# Altium project Mynd_USB_JACK.PrjPcb
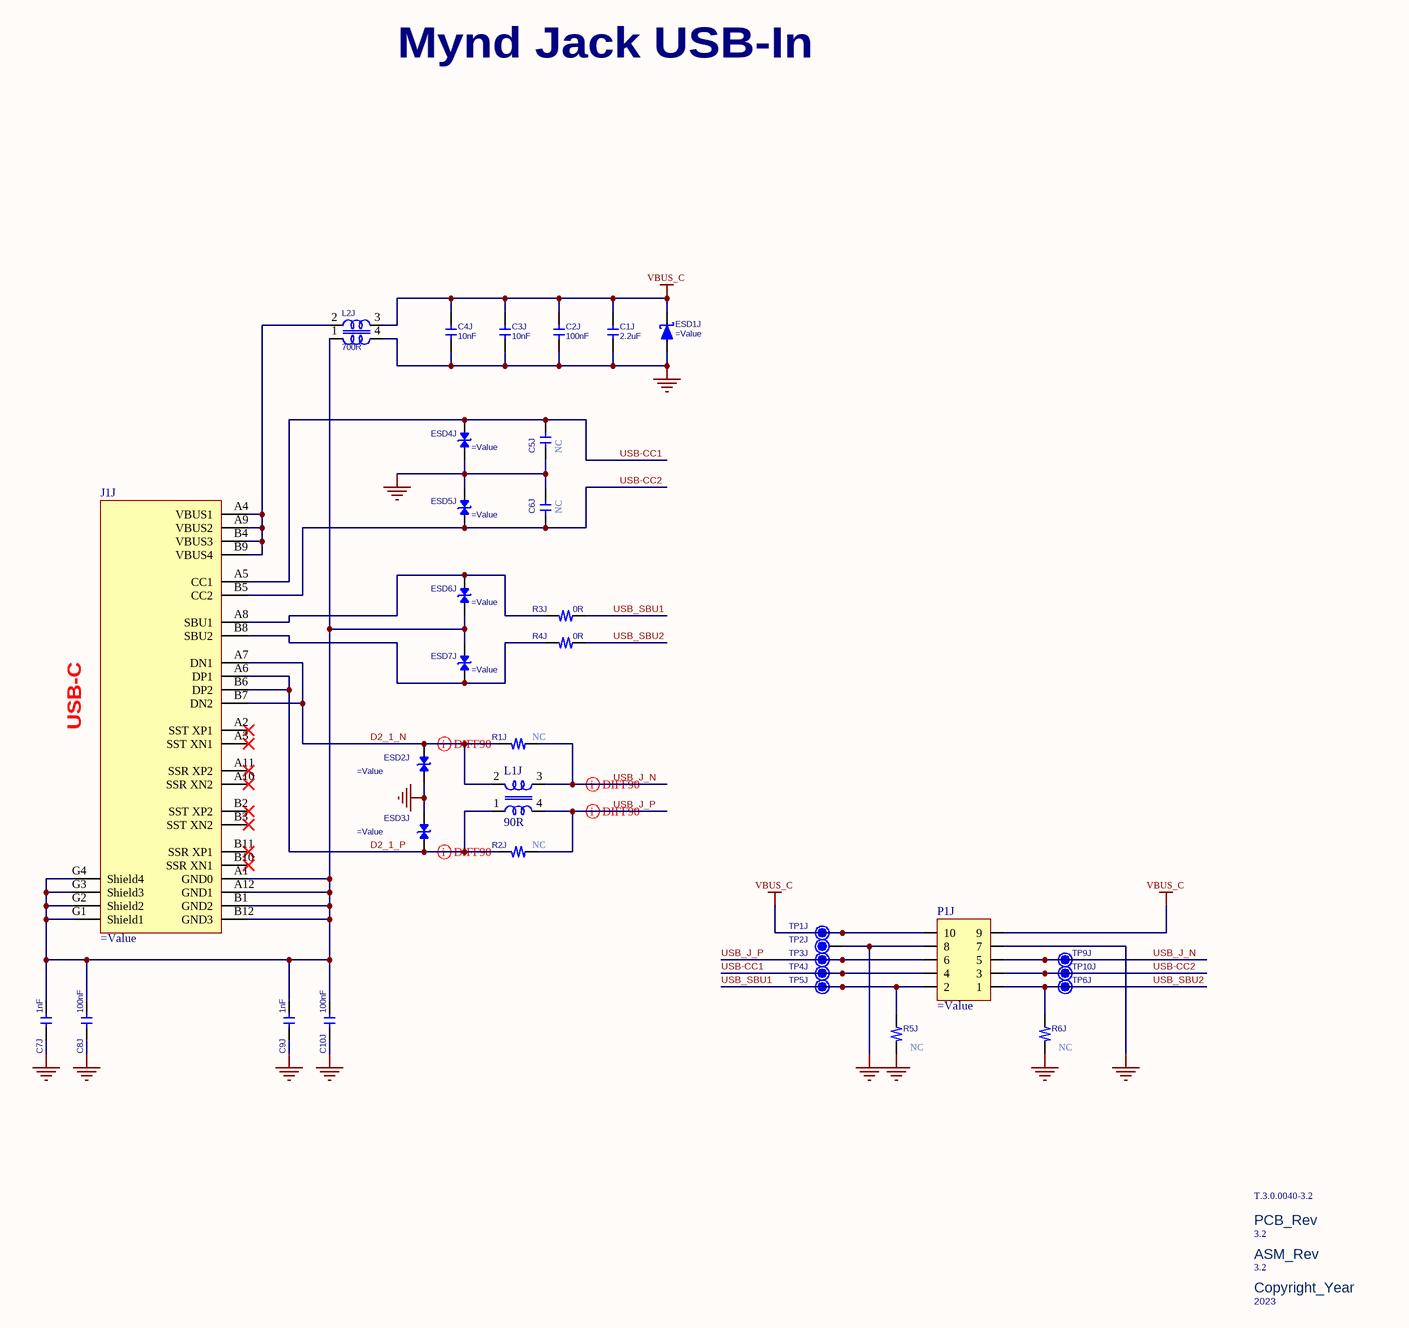
[diagram p0: Mynd_USB_JACK.SchDoc]
Revision: 3.2; Version: T.3.0.0040; SCH_REV: 3.2; SCH_Designer: GuoHui.Lin; SCH_Checker: Aileen.Zheng; SCH_Approver: JianHua.Zhong; REV_DATE: 20231025; Projects.TemplateItemRevisionGuid: B682C188-0E56-4AC2-9775-457A46DFECEF; PCB_REV: 3.2; Model_NO: PS2307; ISSUE_DATE: 20240117; Engineer: JMB, TB, JM; DOC_NO_SCH_DWG: Mynd_USB_Jack; Copyright_Year: 2023; CompanyName: Lautsprecher Teufel GmbH; ASM_Rev: 3.2; Address3: Germany; Address2: 10787 Berlin; Address1: Budapester Straße 44
1 sheet, 39 parts. Net scope: global (net labels, ports and power ports of the same name join across sheets).
Board file: Mynd_USB_JACK.PcbDoc

## Sheet Mynd_USB_JACK.SchDoc: Mynd-USB-Jack
size A3; ApprovedBy: JianHua.Zhong; CheckedBy: Aileen.Zheng; DrawnBy: GuoHui.Lin; DocumentNumber: 1; Revision: 3.2; SheetNumber: 1; SheetTotal: 1; Model NO.: PS2307; ISSUE DATE: 20240117; REV DATE: 20231025

### Parts
C1J  2.2uF  [C0805_145]
C2J  100nF  [C0603X100]
C3J  10nF  [C0603X100]
C4J  10nF  [C0603X100]
C5J  470pF  [C0603X80]  (value not drawn)
C6J  470pF  [C0603X80]  (value not drawn)
C7J  1nF  [C0603X100]
C8J  100nF  [C0603X100]
C9J  1nF  [C0603X100]
C10J  100nF  [C0603X100]
ESD1J  (no value)  [SOD-123FL]
ESD2J  (no value)  [DFN2_100X60X50_65]
ESD3J  (no value)  [DFN2_100X60X50_65]
ESD4J  (no value)  [DFN2_100X60X50_65]
ESD5J  (no value)  [DFN2_100X60X50_65]
ESD6J  (no value)  [DFN2_100X60X50_65]
ESD7J  (no value)  [DFN2_100X60X50_65]
J1J  (no value)  [USB_TYPE_C_HC_0768]
L1J  90R  [CET2012D]
L2J  700R  [DU_IND_SMD_SCM7060]
P1J  (no value)  [WB200AW_2x5P]
R1J  0R  [R0402]  (value not drawn)
R2J  0R  [R0402]  (value not drawn)
R3J  0R  [R0402]
R4J  0R  [R0402]
R5J  NC  [R0402]  (value not drawn)
R6J  NC  [R0402]  (value not drawn)
Teufel_ASM_Label1J  3.2  [Teufel_ASM_Rev]  (no BOM)
Teufel_Copyright1K  2023  [TEUFEL_COPYRIGHT]  (no BOM)
Teufel_PCB_Label1J  3.2  [Teufel_PCB_Rev]  (no BOM)
Teufel_PCB_Logo1k  T.3.0.0040-3.2  [Teufel_NoLogo]  (no BOM)
TP1J  TP12  [TP120]  (value not drawn)  (no BOM)
TP2J  TP12  [TP120]  (value not drawn)  (no BOM)
TP3J  TP12  [TP120]  (value not drawn)  (no BOM)
TP4J  TP12  [TP120]  (value not drawn)  (no BOM)
TP5J  TP12  [TP120]  (value not drawn)  (no BOM)
TP6J  TP12  [TP120]  (value not drawn)  (no BOM)
TP9J  TP12  [TP120]  (value not drawn)  (no BOM)
TP10J  TP12  [TP120]  (value not drawn)  (no BOM)

### Nets
GND: C1J.2 C2J.2 C3J.2 C4J.2 C5J.2 C6J.2 C7J.2 C8J.2 C9J.2 C10J.2 ESD1J.A ESD2J.1 ESD3J.1 ESD4J.2 ESD5J.2 L2J.4 P1J.7 P1J.8 R5J.1 R6J.1 TP2J.1
VBUS_C: C1J.1 C2J.1 C3J.1 C4J.1 ESD1J.K L2J.3 P1J.9 P1J.10 TP1J.1
D2_1_N: ESD2J.2 J1J.A7(DN1) J1J.B7(DN2) L1J.2 R1J.1
D2_1_P: ESD3J.2 J1J.A6(DP1) J1J.B6(DP2) L1J.1 R2J.1
USB-CC1: C5J.1 ESD4J.1 J1J.A5(CC1) P1J.4 TP4J.1
USB-CC2: C6J.1 ESD5J.1 J1J.B5(CC2) P1J.3 TP10J.1
USB_J_N: L1J.3 P1J.5 R1J.2 TP9J.1
USB_J_P: L1J.4 P1J.6 R2J.2 TP3J.1
USB_SBU1: P1J.2 R3J.2 R5J.2 TP5J.1
USB_SBU2: P1J.1 R4J.2 R6J.2 TP6J.1
NetC7J_1: C7J.1 C8J.1 C9J.1 C10J.1 ESD6J.1 ESD7J.1 J1J.A1(GND0) J1J.A12(GND1) J1J.B1(GND2) J1J.B12(GND3) J1J.G1(Shield1) J1J.G2(Shield2) J1J.G3(Shield3) J1J.G4(Shield4) L2J.1
NetESD6J_2: ESD6J.2 J1J.A8(SBU1) R3J.1
NetESD7J_2: ESD7J.2 J1J.B8(SBU2) R4J.1
NetJ1J_A4: J1J.A4(VBUS1) J1J.A9(VBUS2) J1J.B4(VBUS3) J1J.B9(VBUS4) L2J.2

Not connected (* = marked no-connect by the designer): J1J A2(SST_XP1)* A3(SST_XN1)* A10(SSR_XN2)* A11(SSR_XP2)* B2(SST_XP2)* B3(SST_XN2)* B10(SSR_XN1)* B11(SSR_XP1)*

### Layout directives
differential pair; differential pair class USB_HS_LINES: D2_1_N, D2_1_P, USB_J_N, USB_J_P

### Notes on the sheet
- Mynd Jack USB-In
- (near C5J) NC
- (near C6J) NC
- (near J1J) USB-C
- (near R1J) NC
- (near R2J) NC
- (near R5J) NC
- (near R6J) NC
- Revision:
- Lautspreecher Teufel GmbH
- Budapester Straße 44
- 10787 Berlin
- Germany
- Page Title:
- Engineer:
- Project:
- Version:
- Rev:
- modified:
- Date:
- Size:
- A3
- File Name:
- Page:
- of
- (in symbol CMP-00086-3) Copyright_Year
- (in symbol CMP-00087-3) PCB_Rev
- (in symbol CMP-00088-3) ASM_Rev

### Library data of the parts
C1J = P-001-0127-42: GPHF $ SMD M CAP 2.2uF 50V ±10% 0805 X5R; Manufacturer: Multi-Sourced; Part_Number: Generic; Part_Type: Capacitor ceramic SMT; Tolerance: ±10%; TemperatureRange: X5R; Value: 2.2uF; Voltage: 50V
C2J C8J C10J = P-001-0074-64: GPHF SMD M CAP 100nF 50V ±10% 0603 X7R; Manufacturer: Multi-Sourced; Part_Number: Generic; Part_Type: Capacitor ceramic SMT; Tolerance: ±10%; TemperatureRange: X7R; Value: 100nF; Voltage: 50V
C3J C4J = P-001-0058-45: PSHF SMD M CAP 10nF 50V ±10% 0603 X7R; Manufacturer: Multi-Sourced; Part_Number: Generic; Part_Type: Capacitor ceramic SMT; Tolerance: ±10%; TemperatureRange: X7R; Value: 10nF; Voltage: 50V
C5J C6J = P-001-0647-8: PSHF SMD CAP 470pF 50V 10%; Manufacturer: Multi-Sourced; Part_Number: Generic; Part_Type: Capacitor ceramic SMT; TemperatureRange: X7R; Tolerance: ±10%; Value: 470pF; Voltage: 50V
C7J C9J = P-001-0073-51: GPHF SMD M CAP 1nF 50V ±10% 0603 X7R; Manufacturer: Multi-Sourced; Part_Number: Generic; Part_Type: Capacitor ceramic SMT; Tolerance: ±10%; TemperatureRange: X7R; Value: 1nF; Voltage: 50V
ESD1J = R-001-1700-2: SMD TVS 2P 26 SOD-123FL SMF26AL JJW; Part_Type: Semiconductor Diode TVS SMT; Current: 1A; Voltage: 26; Manufacturer: JJW; Part_Number: SMF26AL; Value: SMF26AL
ESD2J ESD3J ESD4J ESD5J ESD6J ESD7J = R-001-1582-2: SMD TVS 2P 5.5 DFN1006 CESD0501CU CTE; Part_Type: Semiconductor Diode TVS SMT; Voltage: 5.5V; Manufacturer: CTE; Part_Number: CESD0501CU; Value: CESD0501CU
J1J = C-001-0947-5: SMD USB JACK 24P TID VERIFY; Manufacturer: FTS; Part_Number: NG-HC-0412; Part_Type: Jack USBC SMT; Value: NG-HC-0412
L1J = S-001-0426-3: COMMON MODE COIL 90Ohm 100MHz 400mA; Manufacturer: CET CHAMPI; Part_Number: CET2012A-900S; Part_Type: Ferrite Bead SMT; Frequency: 100MHz; Current: 400mA; Value: 90R
L2J = S-001-0352-17: GPCOMMON MODE COIL 700Ohm 100MHz 125V 4A; Manufacturer: CET CHAMPI; Part_Number: CET706038-701T02; Part_Type: Inductor common Mode SMT; Frequency: 100MHz; Voltage: 125V; Current: 4A; Value: 700R
P1J = C-001-1113-2: SMD WTB CONNECTOR 10P P2.0mm TIN; Manufacturer: MINGHENG; Part_Number: WB200AW-10; Part_Type: Connector WTB SMT; Value: WB200AW-10; System: Connector
R1J R2J R5J R6J = Q-001-0802-8: SMD THICK FILM RES. 0Ohm 1/16W 1% 0402; Manufacturer: Multi-Sourced; Part_Number: Generic; Part_Type: Resistor SMT; Wattage: 1/16W; Tolerance: 1%
  R1J R2J: Value: 0R
  R5J R6J: Value: NC
R3J R4J = Q-001-0330-113: GPHF SMD RES. 0OHM 1/16W 5% 0402; Manufacturer: Multi-Sourced; Part_Number: Generic; Part_Type: Resistor SMT; Wattage: 1/16W; Tolerance: 5%; Value: 0R
Teufel_ASM_Label1J = CMP-00088-3: Teufel_ASM_Rev; Value: 3.2
Teufel_Copyright1K = CMP-00086-3: Teufel_Copyright_Year; Value: 2023
Teufel_PCB_Label1J = CMP-00087-3: Teufel_PCB_Label; Value: 3.2
Teufel_PCB_Logo1k = Teufel NoLogo: Teufel PCB NoLogo
TP1J TP2J TP3J TP4J TP5J TP6J TP9J TP10J = N-001-00010-2: Test Point; Design Item ID: TP

## Assembly variants
Variant-of-NotFitted-Project: all parts fitted